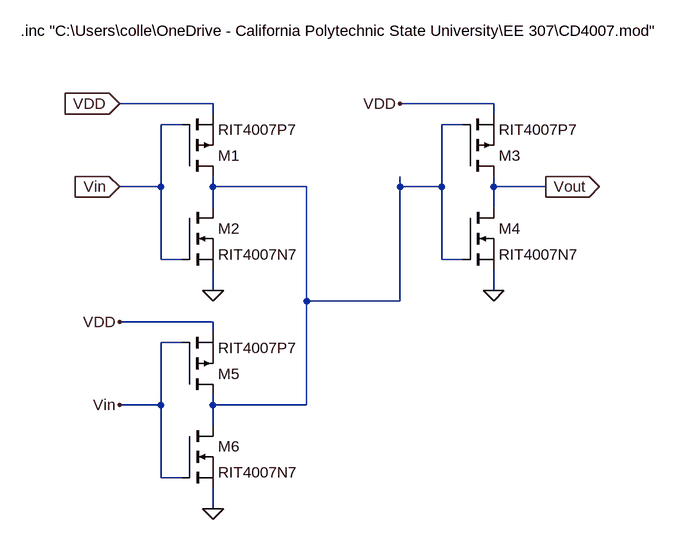
[diagram p0: schematic Circuit1_inverter.asc]
Circuit1_inverter.asc, the LTspice schematic file:
Version 4
SHEET 1 880 680
WIRE 96 16 -48 16
WIRE 528 16 384 16
WIRE 96 32 96 16
WIRE 528 32 528 16
WIRE 48 48 16 48
WIRE 480 48 448 48
WIRE 16 144 16 48
WIRE 16 144 -48 144
WIRE 96 144 96 128
WIRE 240 144 96 144
WIRE 384 144 384 128
WIRE 448 144 448 48
WIRE 448 144 384 144
WIRE 528 144 528 128
WIRE 608 144 528 144
WIRE 96 176 96 144
WIRE 528 176 528 144
WIRE 16 256 16 144
WIRE 48 256 16 256
WIRE 448 256 448 144
WIRE 480 256 448 256
WIRE 96 304 96 272
WIRE 528 304 528 272
WIRE 240 320 240 144
WIRE 384 320 384 144
WIRE 384 320 240 320
WIRE 96 352 -48 352
WIRE 96 368 96 352
WIRE 48 384 16 384
WIRE 16 480 16 384
WIRE 16 480 -48 480
WIRE 96 480 96 464
WIRE 240 480 240 320
WIRE 240 480 96 480
WIRE 96 512 96 480
WIRE 16 592 16 480
WIRE 48 592 16 592
WIRE 96 640 96 608
FLAG 96 304 0
FLAG -48 144 Vin
IOPIN -48 144 In
FLAG -48 16 VDD
IOPIN -48 16 In
FLAG 528 304 0
FLAG 384 16 VDD
FLAG 608 144 Vout
IOPIN 608 144 Out
FLAG 96 640 0
FLAG -48 480 Vin
FLAG -48 352 VDD
SYMBOL pmos 48 128 M180
SYMATTR InstName M1
SYMATTR Value RIT4007P7
SYMBOL nmos 48 176 R0
SYMATTR InstName M2
SYMATTR Value RIT4007N7
SYMBOL pmos 480 128 M180
SYMATTR InstName M3
SYMATTR Value RIT4007P7
SYMBOL nmos 480 176 R0
SYMATTR InstName M4
SYMATTR Value RIT4007N7
SYMBOL pmos 48 464 M180
SYMATTR InstName M5
SYMATTR Value RIT4007P7
SYMBOL nmos 48 512 R0
SYMATTR InstName M6
SYMATTR Value RIT4007N7
TEXT -200 -96 Left 2 !.inc "C:\\Users\\colle\\OneDrive - California Polytechnic State University\\EE 307\\CD4007.mod"

The netlist it stands for:
* Circuit1_inverter.asc
M1 N001 Vin VDD VDD RIT4007P7
M2 N001 Vin 0 0 RIT4007N7
M3 Vout N001 VDD VDD RIT4007P7
M4 Vout N001 0 0 RIT4007N7
M5 N001 Vin VDD VDD RIT4007P7
M6 N001 Vin 0 0 RIT4007N7
.model NMOS NMOS
.model PMOS PMOS
.lib standard.mos
.inc "C:\Users\colle\OneDrive - California Polytechnic State University\EE 307\CD4007.mod"
.backanno
.end